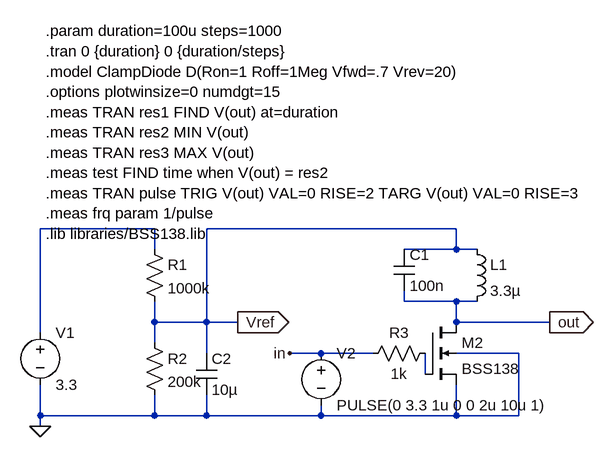
[diagram p0: schematic inductive-sensor-with-fet.asc]
inductive-sensor-with-fet.asc, the LTspice schematic file:
Version 4
SHEET 1 2696 1776
WIRE 48 112 -128 112
WIRE 512 112 128 112
WIRE 48 144 48 112
WIRE 512 144 512 112
WIRE 512 144 432 144
WIRE 544 144 512 144
WIRE 432 224 432 208
WIRE 512 224 432 224
WIRE 544 224 512 224
WIRE 48 256 48 224
WIRE 128 256 128 112
WIRE 128 256 48 256
WIRE 176 256 128 256
WIRE 512 256 512 224
WIRE 656 256 512 256
WIRE -128 272 -128 112
WIRE 48 288 48 256
WIRE 128 304 128 256
WIRE 304 304 256 304
WIRE 384 304 304 304
WIRE 608 304 512 304
WIRE 464 336 464 304
WIRE -128 400 -128 352
WIRE 48 400 48 368
WIRE 48 400 -128 400
WIRE 128 400 128 368
WIRE 128 400 48 400
WIRE 304 400 304 384
WIRE 304 400 128 400
WIRE 512 400 512 352
WIRE 512 400 304 400
WIRE 608 400 608 304
WIRE 608 400 512 400
WIRE -128 416 -128 400
FLAG -128 416 0
FLAG 656 256 out
IOPIN 656 256 Out
FLAG 256 304 in
FLAG 176 256 Vref
IOPIN 176 256 Out
DATAFLAG 592 256 "$"
SYMBOL Voltage -128 256 R0
SYMATTR InstName V1
SYMATTR Value 3.3
SYMBOL Cap 416 144 R0
SYMATTR InstName C1
SYMATTR Value 100n
SYMATTR SpiceLine Rser=.141
SYMBOL ind 528 128 R0
SYMATTR InstName L1
SYMATTR Value 3.3µ
SYMATTR SpiceLine Rser=37m
SYMBOL Voltage 304 288 R0
SYMATTR InstName V2
SYMATTR Value PULSE(0 3.3 1u 0 0 2u 10u 1)
SYMBOL Res 32 128 R0
SYMATTR InstName R1
SYMATTR Value 1000k
SYMBOL Res 32 272 R0
SYMATTR InstName R2
SYMATTR Value 200k
SYMBOL Cap 112 304 R0
SYMATTR InstName C2
SYMATTR Value 10µ
SYMATTR SpiceLine Rser=.1
SYMBOL nmos4 464 256 R0
SYMATTR InstName M2
SYMATTR Value BSS138
SYMATTR Prefix X
SYMBOL Res 480 288 R90
WINDOW 0 0 56 VBottom 2
WINDOW 3 32 56 VTop 2
SYMATTR InstName R3
SYMATTR Value 1k
TEXT -120 -192 Left 2 !.param duration=100u steps=1000\n.tran 0 {duration} 0 {duration/steps}\n.model ClampDiode D(Ron=1 Roff=1Meg Vfwd=.7 Vrev=20)\n.options plotwinsize=0 numdgt=15\n.meas TRAN res1 FIND V(out) at=duration\n.meas TRAN res2 MIN V(out)\n.meas TRAN res3 MAX V(out)\n.meas test FIND time when V(out) = res2\n.meas TRAN pulse TRIG V(out) VAL=0 RISE=2 TARG V(out) VAL=0 RISE=3\n.meas frq param 1/pulse\n.lib libraries/BSS138.lib

The netlist it stands for:
* inductive-sensor-with-fet.asc
V1 N001 0 3.3
C1 Vref out 100n Rser=.141
L1 Vref out 3.3µ Rser=37m
V2 in 0 PULSE(0 3.3 1u 0 0 2u 10u 1)
R1 N001 Vref 1000k
R2 Vref 0 200k
C2 Vref 0 10µ Rser=.1
XM2 out N002 0 0 BSS138  ; pins D G S B
R3 N002 in 1k
.param duration=100u steps=1000
.tran 0 {duration} 0 {duration/steps}
.model ClampDiode D(Ron=1 Roff=1Meg Vfwd=.7 Vrev=20)
.options plotwinsize=0 numdgt=15
.meas TRAN res1 FIND V(out) at=duration
.meas TRAN res2 MIN V(out)
.meas TRAN res3 MAX V(out)
.meas test FIND time when V(out) = res2
.meas TRAN pulse TRIG V(out) VAL=0 RISE=2 TARG V(out) VAL=0 RISE=3
.meas frq param 1/pulse
.lib libraries/BSS138.lib
.backanno
.end